# Altium project rv_ledbrick_8ch.PrjPcb
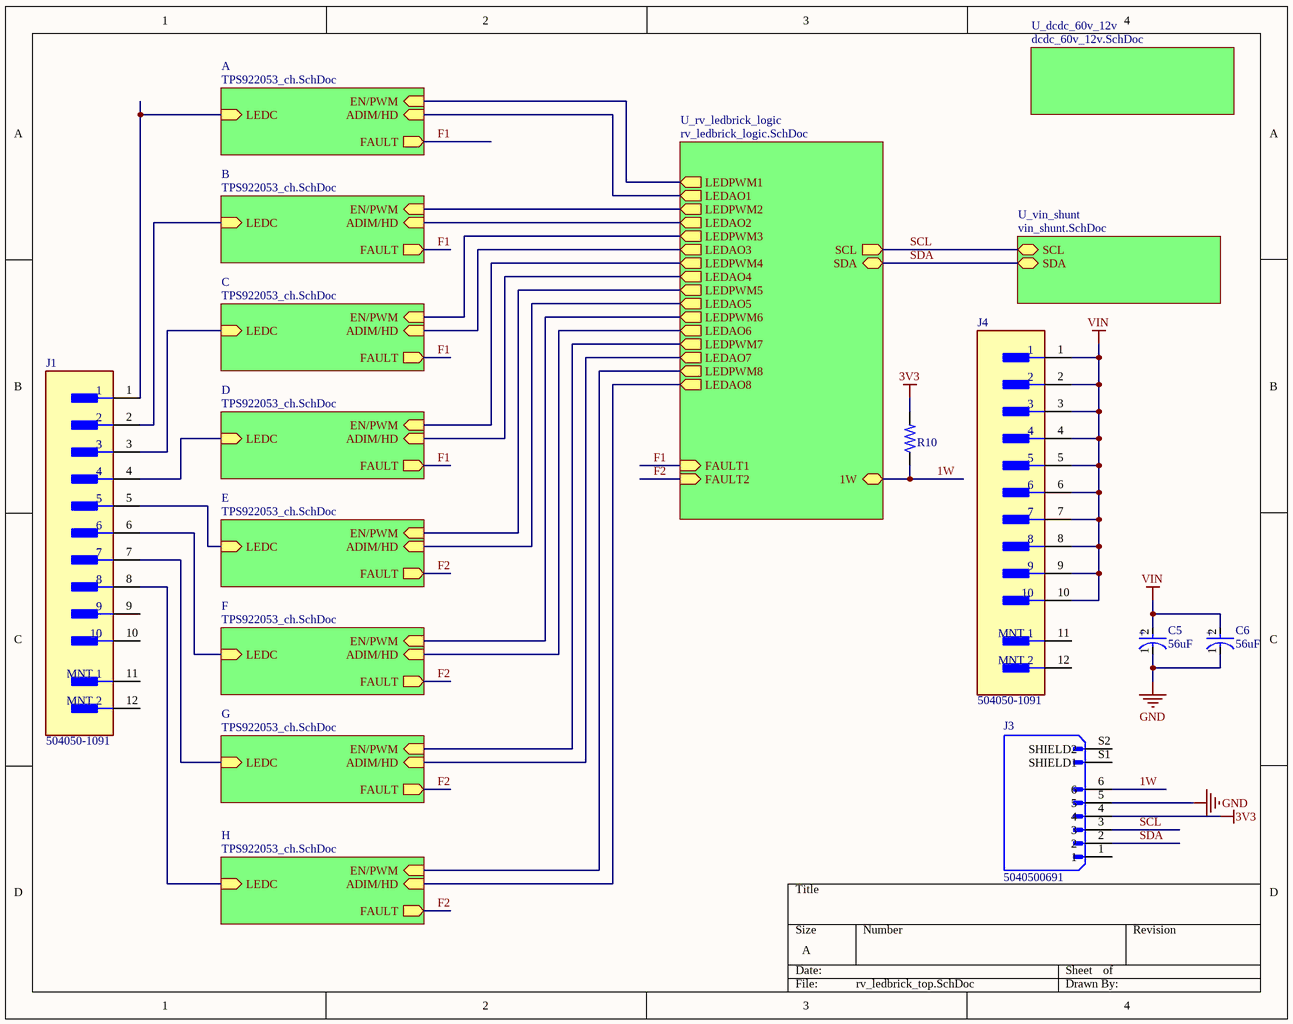
[diagram p0: rv_ledbrick_top.SchDoc]
6 sheets, 212 parts. Net scope: hierarchical (ports join the sheet entries above them; power ports are global).
Board file: rv_ledbrick_8ch.PcbDoc
Sheets:
  rv_ledbrick_top.SchDoc
    A = TPS922053_ch.SchDoc
    B = TPS922053_ch.SchDoc
    C = TPS922053_ch.SchDoc
    D = TPS922053_ch.SchDoc
    E = TPS922053_ch.SchDoc
    F = TPS922053_ch.SchDoc
    G = TPS922053_ch.SchDoc
    H = TPS922053_ch.SchDoc
    U_dcdc_60v_12v = dcdc_60v_12v.SchDoc
    U_rv_ledbrick_logic = rv_ledbrick_logic.SchDoc
      U_usb_input = usb_input.SchDoc
    U_vin_shunt = vin_shunt.SchDoc

## Sheet rv_ledbrick_top.SchDoc
size A; SheetNumber: 1; SheetTotal: 6

### Parts
C5  value 56uF  [FP-OS-CON-SMT-F12-MFG]  (hidden comment: CAP 56uF 80V Poly)
C6  value 56uF  [FP-OS-CON-SMT-F12-MFG]  (hidden comment: CAP 56uF 80V Poly)
J1  504050-1091  [FP-504050-1091-MFG]
J3  5040500691  [MOLEX_5040500691]
J4  504050-1091  [FP-504050-1091-MFG]
R10  4.7k 0603 1%  [RESC1608-IPC-LL]  (value not drawn)

### Sub-sheets
A = TPS922053_ch.SchDoc: LEDC (in), ADIM/HD (in), EN/PWM (in), FAULT (out)
B = TPS922053_ch.SchDoc: LEDC (in), ADIM/HD (in), EN/PWM (in), FAULT (out)
C = TPS922053_ch.SchDoc: LEDC (in), ADIM/HD (in), EN/PWM (in), FAULT (out)
D = TPS922053_ch.SchDoc: LEDC (in), ADIM/HD (in), EN/PWM (in), FAULT (out)
E = TPS922053_ch.SchDoc: LEDC (in), ADIM/HD (in), EN/PWM (in), FAULT (out)
F = TPS922053_ch.SchDoc: LEDC (in), ADIM/HD (in), EN/PWM (in), FAULT (out)
G = TPS922053_ch.SchDoc: LEDC (in), ADIM/HD (in), EN/PWM (in), FAULT (out)
H = TPS922053_ch.SchDoc: LEDC (in), ADIM/HD (in), EN/PWM (in), FAULT (out)
U_dcdc_60v_12v = dcdc_60v_12v.SchDoc: no entries
U_rv_ledbrick_logic = rv_ledbrick_logic.SchDoc: SDA (bidir), SCL (out), LEDPWM1 (out), LEDPWM2 (out), LEDPWM3 (out), LEDPWM4 (out), LEDPWM5 (out), LEDPWM6 (out), LEDPWM7 (out), LEDPWM8 (out), LEDAO1 (out), LEDAO2 (out), LEDAO3 (out), LEDAO4 (out), LEDAO5 (out), LEDAO6 (out), LEDAO7 (out), LEDAO8 (out), FAULT1 (in), FAULT2 (in), 1W (bidir)
U_vin_shunt = vin_shunt.SchDoc: SCL (bidir), SDA (bidir)

### Nets
3V3: J3.4 R10.2
GND: C5.1(C) C6.1(C) J3.5
VIN: C5.2(A) C6.2(A) J4.1 J4.2 J4.3 J4.4 J4.5 J4.6 J4.7 J4.8 J4.9 J4.10
1W: J3.6 R10.1 ; sheet U_rv_ledbrick_logic/1W
CSP: J1.1 ; sheet A/LEDC
CSP: J1.2 ; sheet B/LEDC  [a separate net that carries the same name]
CSP: J1.3 ; sheet C/LEDC  [a separate net that carries the same name]
CSP: J1.4 ; sheet D/LEDC  [a separate net that carries the same name]
CSP: J1.5 ; sheet E/LEDC  [a separate net that carries the same name]
CSP: J1.6 ; sheet F/LEDC  [a separate net that carries the same name]
CSP: J1.7 ; sheet G/LEDC  [a separate net that carries the same name]
CSP: J1.8 ; sheet H/LEDC  [a separate net that carries the same name]
F1: sheet A/FAULT, sheet B/FAULT, sheet C/FAULT, sheet D/FAULT, sheet U_rv_ledbrick_logic/FAULT1
F2: sheet E/FAULT, sheet F/FAULT, sheet G/FAULT, sheet H/FAULT, sheet U_rv_ledbrick_logic/FAULT2
LEDAO1: sheet A/ADIM/HD, sheet U_rv_ledbrick_logic/LEDAO1
LEDAO2: sheet B/ADIM/HD, sheet U_rv_ledbrick_logic/LEDAO2
LEDAO3: sheet C/ADIM/HD, sheet U_rv_ledbrick_logic/LEDAO3
LEDAO4: sheet D/ADIM/HD, sheet U_rv_ledbrick_logic/LEDAO4
LEDAO5: sheet E/ADIM/HD, sheet U_rv_ledbrick_logic/LEDAO5
LEDAO6: sheet F/ADIM/HD, sheet U_rv_ledbrick_logic/LEDAO6
LEDAO7: sheet G/ADIM/HD, sheet U_rv_ledbrick_logic/LEDAO7
LEDAO8: sheet H/ADIM/HD, sheet U_rv_ledbrick_logic/LEDAO8
LEDPWM1: sheet A/EN/PWM, sheet U_rv_ledbrick_logic/LEDPWM1
LEDPWM2: sheet B/EN/PWM, sheet U_rv_ledbrick_logic/LEDPWM2
LEDPWM3: sheet C/EN/PWM, sheet U_rv_ledbrick_logic/LEDPWM3
LEDPWM4: sheet D/EN/PWM, sheet U_rv_ledbrick_logic/LEDPWM4
LEDPWM5: sheet E/EN/PWM, sheet U_rv_ledbrick_logic/LEDPWM5
LEDPWM6: sheet F/EN/PWM, sheet U_rv_ledbrick_logic/LEDPWM6
LEDPWM7: sheet G/EN/PWM, sheet U_rv_ledbrick_logic/LEDPWM7
LEDPWM8: sheet H/EN/PWM, sheet U_rv_ledbrick_logic/LEDPWM8
SCL: J3.3 ; sheet U_rv_ledbrick_logic/SCL, sheet U_vin_shunt/SCL
SDA: J3.2 ; sheet U_rv_ledbrick_logic/SDA, sheet U_vin_shunt/SDA

Not connected (* = marked no-connect by the designer): J1 9 10 11(MNT_1) 12(MNT_2); J3 1 S1(SHIELD1) S2(SHIELD2); J4 11(MNT_1) 12(MNT_2)

### Notes on the sheet
- (in symbol CMP-001-00120-1) +

### Library data of the parts
C5 C6 = CMP-001-00120-1: Conductive Polymer Aluminum Solid Capacitor 56uF 20% 80V Surface Mount T/R; ESR (Equivalent Series Resistance): 28mR; Mounting Technology: Surface Mount; Min Operating Temperature: -55°C; RoHS Compliant: Yes; Max Operating Temperature: 125°C; Voltage Rating: 80V; Series: OS-CON™, SXV; Tolerance: 20%; Case/Package: Radial
J1 J4 = CMP-002-00088-1: Conn Wire to Board HDR 10 POS 1.5mm Solder RA SMD Pico-Lock™ T/R
J3 = CMP-253-000000-2: CONN WIRE TO BOARD RA 6POS; Number of Circuits: 6; Gender: Male; Voltage Rating: 150V; Connector Type: Blade Pin; Current Rating: 3A; Glow Wire Compliant: Non-compliant; Pitch: 1.5mm; Component Type: Standard; Pin Count: 8; Housing Color: Black; Min Operating Temperature: -25°C; Halogen Free: Low Halogen; Value: *; Number of Positions: 6; Orientation: Right Angle; Color: Black; Design Item ID: 5040500691; Availability: Unavailable; Price: None; Max Operating Temperature: 85°C; Packaging: Tape and Reel; Length: 13.55mm; Number of Rows: 1; Contact Gender: Male; Number of Contacts: 6; Contact Plating: Gold; Package Quantity: 2700; Radiation Hardening: No; Termination: SMD/SMT; Contact Material: Copper Alloy,Copper; Source: 5040500691.SchLib; RoHS Compliant: Yes; Housing Material: Thermoplastic; MP: 5040500691; Flammability Rating: UL94 V-0; Mounting Technology: Surface Mount; Package: None; Depth: 6.44mm
R10 = CMP-009-00205-1: RES SMD 4.7K OHM 1% 1/10W 0603

## Sheet TPS922053_ch.SchDoc
size A; SheetNumber: 2; SheetTotal: 5
Used 8 times, as channels A, B, C, D, E, F, G, H. Parts and nets are listed once, with the designators drawn on the sheet.
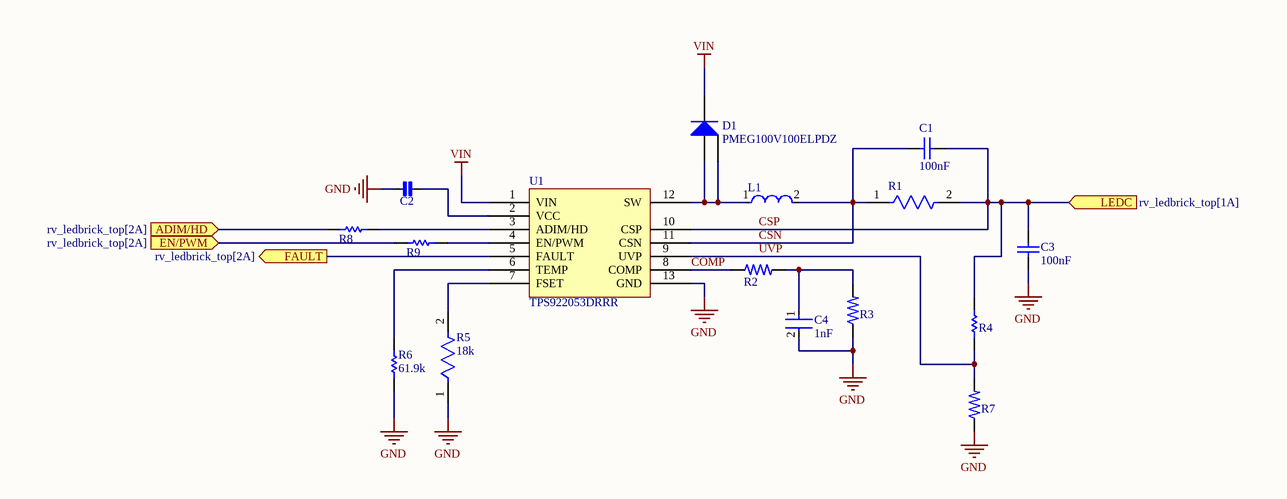
[diagram p1: TPS922053_ch.SchDoc]

### Parts
C1  value 100nF  [CAPC2013X94X50NL20T25]  (hidden comment: 0.1uF X7R 100V 0805)
C2  CAP 1uF 10V X7R 0603  [FP-CL10-IPC_B]  (value not drawn)
C3  value 100nF  [CAPC2013X94X50NL20T25]  (hidden comment: 0.1uF X7R 100V 0805)
C4  value 1nF  [FP-0603-L_1_6_0_15-W_0_81-IPC_B]  (hidden comment: 0.001uF 50V 0603 X7R)
D1  PMEG100V100ELPDZ  [DFN355P580X82-3N]
L1  MWSA0603S-100MT  [FP-IHLP-2525CZ-FP_2_413x3-MFG]  (value not drawn)
R1  MFL12HR100FT  [FP-CRA2512-MFG]  (value not drawn)
R2  1K 0603 1%  [RESC1608-IPC-NL]  (value not drawn)
R3  1M 0603 1%  [RESC1608-IPC-NL]  (value not drawn)
R4  309k 0603 1%  [RESC1608-IPC-NL]  (value not drawn)
R5  value 18k  [FP-CRCW0603-e3-IPC_B]  (hidden comment: 18k 0603)
R6  value 61.9k  [RESC1608X55X30ML15T15]  (hidden comment: ERJ-3EKF6192V)
R7  100k 0603 1%  [RESC1608-IPC-NL]  (value not drawn)
R8  10R 0603 1%  [RESC1608-IPC-NL]  (value not drawn)
R9  10R 0603 1%  [RESC1608-IPC-NL]  (value not drawn)
U1  TPS922053DRRR  [SON50P300X100_HS-13N]

### Ports
ADIM/HD (in, see rv_ledbrick_top[2A]), EN/PWM (in, see rv_ledbrick_top[2A]), FAULT (out, see rv_ledbrick_top[2A]), LEDC (in, see rv_ledbrick_top[1A])

### Nets
GND: C2.1 C3.1 C4.2 R3.1 R5.1 R6.1 R7.1 U1.13(GND)
VIN: D1.3(K) U1.1(VIN)
ADIM/HD: R8.1 ; port ADIM/HD
COMP: R2.1 U1.8(COMP)
CSN: C1.2 L1.2 R1.1 U1.11(CSN)
CSP: C1.1 C3.2 R1.2 R4.2 U1.10(CSP) ; port LEDC
EN/PWM: R9.1 ; port EN/PWM
FAULT: U1.5(FAULT) ; port FAULT
UVP: R4.1 R7.2 U1.9(UVP)
NetC2_2: C2.2 U1.2(VCC)
NetC4_1: C4.1 R2.2 R3.2
NetD1_1: D1.1(A) D1.2(A2) L1.1 U1.12(SW)
NetR5_2: R5.2 U1.7(FSET)
NetR6_2: R6.2 U1.6(TEMP)
NetR8_2: R8.2 U1.3(ADIM/HD)
NetR9_2: R9.2 U1.4(EN/PWM)

### Channels
A: designators end in _A; ports ADIM/HD=LEDAO1 EN/PWM=LEDPWM1 FAULT=F1 LEDC=CSP
B: designators end in _B; ports ADIM/HD=LEDAO2 EN/PWM=LEDPWM2 FAULT=F1 LEDC=CSP
C: designators end in _C; ports ADIM/HD=LEDAO3 EN/PWM=LEDPWM3 FAULT=F1 LEDC=CSP
D: designators end in _D; ports ADIM/HD=LEDAO4 EN/PWM=LEDPWM4 FAULT=F1 LEDC=CSP
E: designators end in _E; ports ADIM/HD=LEDAO5 EN/PWM=LEDPWM5 FAULT=F2 LEDC=CSP
F: designators end in _F; ports ADIM/HD=LEDAO6 EN/PWM=LEDPWM6 FAULT=F2 LEDC=CSP
G: designators end in _G; ports ADIM/HD=LEDAO7 EN/PWM=LEDPWM7 FAULT=F2 LEDC=CSP
H: designators end in _H; ports ADIM/HD=LEDAO8 EN/PWM=LEDPWM8 FAULT=F2 LEDC=CSP

### Library data of the parts
C1 C3 = CMP-001-00130-1: Ceramic Capacitor, Multilayer, Ceramic, 100V, 5% +Tol, 5% -Tol, X7R, 15% TC, 0.1uF, Surface Mount, 0805; Multilayer: Yes; Packaging: Tape and Reel; Case/Package: 0805; RoHS Compliant: Yes; JESD-609 Code: e3; Temperature Characteristics Code: X7R; Tolerance  (fill in as +-): 5%; Height: 1.4mm; Tolerance (fill in as +-): 5%; Length: 2.01mm; Terminal Finish: Nickel; Package Style: SMTMeter; Mounting Technology: Surface Mount; Reach SVHC Compliant: Yes; Max Operating Temperature: 125°C; Termination: Wraparound; Dielectric Material: Ceramic; Width: 1.25mm; Min Operating Temperature: -55°C; Package Shape: Rectangular; Pins: 2; Capacitor Type: Ceramic; Rated DC Voltage (URdc): 100V
C2 = CMP-001-00085-7: Cap Ceramic 1uF 10V X7R 10% SMD 0603 125C Paper T/R
C4 = CMP-001-00131-2: Ceramic Capacitor, Multilayer, Ceramic, 50V, 10% +Tol, 10% -Tol, X7R, 15% TC, 0.001uF, Surface Mount, 0603; Multilayer: Yes; Rated DC Voltage (URdc): 50V; JESD-609 Code: e3; Package Style: SMTMeter; Width: 0.81mm; Terminal Finish: Nickel; Tolerance  (fill in as +-): 10%; RoHS Compliant: Yes; Mounting Technology: Surface Mount; Min Operating Temperature: -55°C; Tolerance (fill in as +-): 10%; Case/Package: 0603; Capacitor Type: Ceramic; Temperature Characteristics Code: X7R; Termination: Wraparound; Packaging: Tape and Reel; Length: 1.6mm; Max Operating Temperature: 125°C; Height: 0.9mm; Pins: 2; Reach SVHC Compliant: Yes; Package Shape: Rectangular; Dielectric Material: Ceramic
D1 = CMP-004-00041-2: Rectifier Diode, Schottky, 1 Phase, 1 Element, 100V V(RRM), Silicon; Reverse Recovery Time-Max: 0.014us; Case Connection: CATHODE; Non-rep Pk Forward Current-Max: 170A; Reference Standard: AEC-Q101; Max Reverse Current: 800nA; Package Body Material: Plastic; Number of Phases: 1; Application(s): EFFICIENCY; Forward Voltage: 850mV; Max Power Dissipation: 1.66W; Technology: SCHOTTKY; Reach SVHC Compliant: No; Diode Element Material: SILICON; Terminal Form: Flat; RoHS Compliant: Yes; Max Operating Temperature: 175°C; Rep Pk Reverse Voltage-Max: 100V; Diode Type: RECTIFIER; Min Operating Temperature: -55°C; Surface Mount: Yes; Package Shape: Rectangular; JESD-30 Code: R-PDSO-F3; Terminal Position: DUAL; Number of Elements: 1; Package Style: SMALL OUTLINEMeter; Pins: 3
L1 = CMP-006-00037-1: General Purpose Inductor, 10uH, 20%, 1 Element, Composite-Core, SMD, 2525; Case/Size Code: 2525; Inductor Application: HIGH CURRENT INDUCTOR; Package Length: 6.86mm; Shape/Size Description: RECTANGULAR PACKAGE; Package Height: 3mm; Core Material: Ferrite; Max Current Rating: 4A; Test Frequency: 100kHz; DC Resistance (DCR): 71.2mR; Channels: 1; Package Width: 6.47mm; Shielding: Shielded; Pins: 2; Terminal Placement: Dual Ended; Min Operating Temperature: -55°C; Inductance-Nom (L): 10uH; Surface Mount: Yes; Package Style: SMTMeter; Packaging: Tape and Reel; RoHS Compliant: Yes; Termination: Wraparound; Max Operating Temperature: 125°C; Terminal Finish: Nickel; Inductor Type: GENERAL PURPOSE INDUCTOR; Reach SVHC Compliant: Yes; Tolerance: 20%; JESD-609 Code: e3; Construction: Shielded
R1 = CMP-009-00243-1: Fixed Resistor, Metal Strip, 3W, 0.1ohm, 5.48V, 1% +/-Tol, 50ppm/Cel, Surface Mount, 2513
R2 = CMP-009-00193-3: Res Thick Film 0603 1K Ohm 1% 1/10W ±100ppm/°C Molded SMD Punched Carrier T/R
R3 = CMP-009-00187-4: VISHAY - CRCW06031M00FKEAHP - RES, AEC-Q200, THICK FILM, 1M, 0603
R4 = CMP-009-00208-2: Res Thick Film 0603 309K Ohm 1% 0.1W(1/10W) ±100ppm/C Molded SMD Paper T/R
R5 = CMP-009-00244-2: Fixed Resistor, Metal Glaze/thick Film, 0.1W, 18000ohm, 75V, 1% +/-Tol, 100ppm/Cel, Surface Mount, 0603; Rated Temperature: 70°C; Package Length: 1.55mm; Reference Standard: AEC-Q200; Package Height: 0.45mm; Package Width: 0.85mm; Power: 100mW; Temperature Coefficient: 100ppm/°C; Case/Package: 0603; Construction: Chip; Package Shape: Rectangular; Tolerance: 1%; Max Operating Temperature: 155°C; RoHS Compliant: Yes; Resistor Type: FIXED RESISTOR; Packaging: Tape and Reel; Terminal Finish: Nickel; Reach SVHC Compliant: Yes; Technology: METAL GLAZE/THICK FILM; Termination: Wraparound; Mounting Technology: Surface Mount; Min Operating Temperature: -55°C; JESD-609 Code: e3; Pins: 2; Package Style: SMTMeter; Working Voltage: 75V
R6 = CMP-009-00245-1: Fixed Resistor, Metal Glaze/thick Film, 0.1W, 61900ohm, 75V, 1% +/-Tol, 100ppm/Cel, Surface Mount, 0603; Package Length: 1.6mm; Package Height: 0.45mm; Rated Temperature: 70°C; Reference Standard: AEC-Q200; Package Width: 0.8mm; Temperature Coefficient: 100ppm/°C; Power: 100mW; Working Voltage: 75V; Reach SVHC Compliant: Yes; Tolerance: 1%; JESD-609 Code: e3; Terminal Finish: Nickel; Resistor Type: FIXED RESISTOR; Min Operating Temperature: -55°C; Max Operating Temperature: 155°C; Technology: METAL GLAZE/THICK FILM; Package Style: SMTMeter; Case/Package: 0603; Construction: Rectangular; Pins: 2; Packaging: Tape and Reel; RoHS Compliant: Yes; Mounting Technology: Surface Mount; Termination: Wraparound; Package Shape: Rectangular
R7 = CMP-009-00203-1: Res Thick Film 1.6 x 0.8 mm 100K Ohm 1% 0.1W(1/10W) 100ppm/ C Molded SMD Paper T/R
R8 R9 = CMP-009-00180-2: YAGEO (PHYCOMP) - RC0603FR-0710RL - RES, THICK FILM, 10R, 1%, 0.1W, 0603; Voltage Rating: 50V; Power Rating: 100mW; Temperature Coefficient: 200ppm/°C; Resistor Type: Thick Film; Width: 0.8mm; Max Operating Temperature: 155°C; Tolerance: 1%; Radiation Hardening: No; Packaging: Tape and Reel; Case Code (Imperial): 0603; Min Operating Temperature: -55°C; Termination: SMD/SMT; Length: 1.6mm; Military Standard: Not; Case Code (Metric): 1608; Contact Plating: Tin,Matte; Height: 0.45mm; REACH SVHC: No SVHC; Voltage Rating (DC): 50V; Number of Pins: 2; Depth: 0.8mm; Lead Free: Lead Free; Resistance: 10R; Case/Package: 0603
U1 = CMP-019-00085-2: 65-V, 2-A buck LED driver with inductive fast dimming and spread spectrum 12-WSON -40 to 125

## Sheet dcdc_60v_12v.SchDoc
size A4; SheetNumber: 5; SheetTotal: 6; SPICEModelCacheOFSRASBJ: <root> / <DocumentId>OFSRASBJ</DocumentId> / <CacheFrame Number="0"> / <Model Name="tmk325b7226_m-pr" Kind="CKT"> / <Text>* TMK325B7226_M-PR     SPICE MODEL  ( General Type ) / *-------------------------------------------------------------------------------------------------------- / * Model Generated by TAIYO YUDEN Corporation (http://www.ty-top.com) / * Version 1.0 / * TAIYO YUDEN Control No. 170508_150330 / * Copyright(c) 2015 TAIYO YUDEN CO.,LTD. All Rights Reserved. / *-------------------------------------------------------------------------------------------------------- / * / * Products Name : Multilayer Ceramic Capacitors / * / * Characteristics : / *     Capacitance : 22 uF , Rated Voltage : 25V , TCC : X7R / *     Case Size : 3.2 x 2.5 / 0.126 x 0.098 [mm/inch] , Thickness : 2.5 / 0.098 [mm/inch] / *     (Conditions: Temperature = 25 degC , DC Bias Current/Voltage = 0A / 0V) / * / * Frequency Range : 40Hz - 3GHz / * / * External Node Assignments : / * / *  1  o---| |---o  2 / * / *-------------------------------------------------------------------------------------------------------- / .SubCkt TMK325B7226_M-PR 1 2 / **************************** / C0 1 110 20.232u / Cm 1 101 1.4192u / C1 101 102 0.46072u / Rc1 101 102 383.24 / C2 102 103 0.25707u / Rc2 102 103 27.255 / C3 103 110 0.063707u / Rc3 103 110 9.0927 / C2m 1 301 2.8514u / C21 301 302 4.5381u / Rc21 301 302 971.82 / C22 302 303 5.7922u / Rc22 302 303 294.55 / C23 303 304 5.617u / Rc23 303 304 301.8 / C24 304 305 2.3653u / Rc24 304 305 34.154 / C25 305 306 1.0031u / Rc25 305 306 28.966 / C26 306 307 0.1463u / Rc26 306 307 1.8028 / C27 307 308 0.26562u / Rc27 307 308 0.93359 / C28 308 309 0.29812u / Rc28 308 309 0.7461 / C29 309 110 3869.2p / Rc29 309 110 3.935 / Rp0 1 110 4.54545454545455Meg / L0 110 120 0.19079n / Lm 120 130 0.18902n / L1 120 121 0.21321n / RL1 121 130 0.13225 / L2 120 122 0.31017n / RL2 122 130 0.16258 / L3 120 123 1.2596n / RL3 123 130 144.01 / CR 120 124 3.8286u / LR 124 125 0.37731n / RR 125 130 10.878m / CL 130 140 3.0471p / LL 130 140 0.15642n / RL 130 140 11.971 / Rs 140 2 2.3557m / **************************** / .ends TMK325B7226_M-PR</Text> / </Model> / </CacheFrame> / </root>
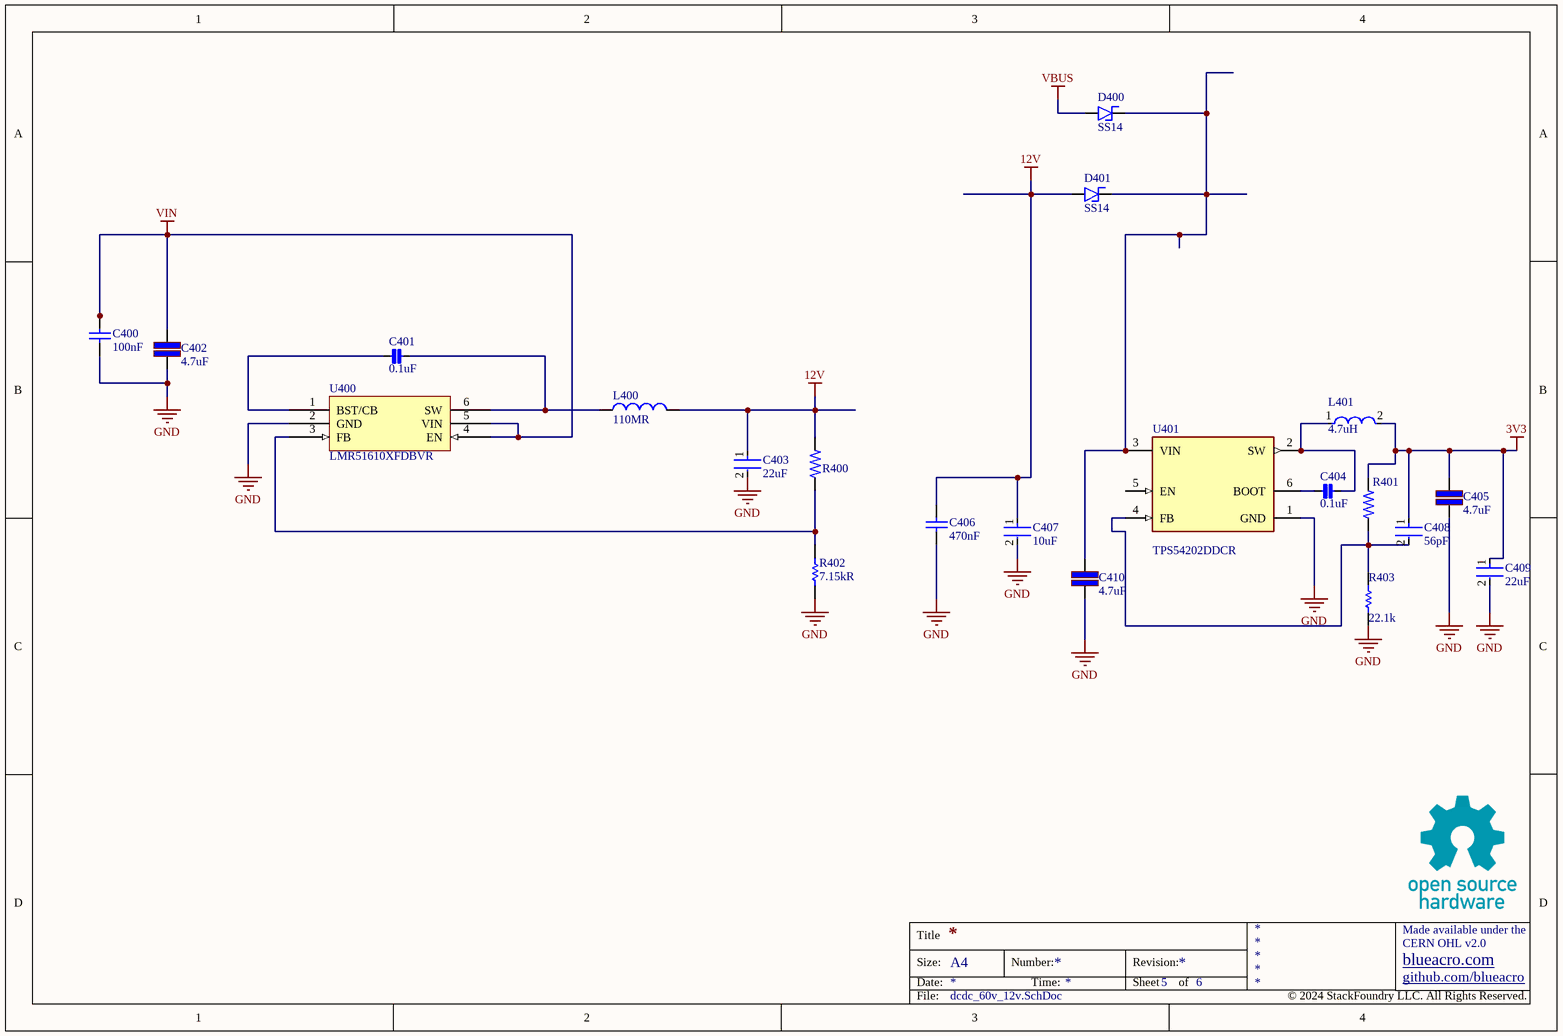
[diagram p2: dcdc_60v_12v.SchDoc]

### Parts
C400  value 100nF  [CAPC2013X94X50ML20T25]  (hidden comment: 0.1uF X7R 100V 0805)
C401  value 0.1uF  [FP-CL10-IPC_B]  (hidden comment: CAP 0.1uF 50V X7R 0603)
C402  value 4.7uF  [CAPC3225X20N]  (hidden comment: CAP 4.7uF 50V X7R 1210)
C403  value 22uF  [FP-1210-L_3_2_0_3-W_2_5_0-MFG]  (hidden comment: CAP 22uF 25V 1210 X7R)
C404  value 0.1uF  [FP-CL10-IPC_B]  (hidden comment: CAP 0.1uF 50V X7R 0603)
C405  value 4.7uF  [CAPC3225X20N]  (hidden comment: CAP 4.7uF 50V X7R 1210)
C406  value 470nF  [CAPC1210(3225)230_M]  (hidden comment: CAP 0.47uF 1210 50V X7R)
C407  value 10uF  [FP-GRM32E-0_2-0_3-MFG]  (hidden comment: CAP 10uF 1210 63V X7R)
C408  value 56pF  [FP-C0603C-CF-IPC_B]  (hidden comment: C0603C560J5GACTU)
C409  value 22uF  [FP-1210-L_3_2_0_3-W_2_5_0-MFG]  (hidden comment: CAP 22uF 25V 1210 X7R)
C410  value 4.7uF  [CAPC3225X20N]  (hidden comment: CAP 4.7uF 50V X7R 1210)
D400  SS14  [SMA]
D401  SS14  [SMA]
L400  value 110MR  [SRR1260-680M-Footprint-1]  (hidden comment: SRR1260-680M)
L401  value 4.7uH  [FP-SRN4018-MFG]  (hidden comment: SRN4018-4R7M)
R400  100k 0603 1%  [RESC1608-IPC-LL]  (value not drawn)
R401  100k 0603 1%  [RESC1608-IPC-LL]  (value not drawn)
R402  value 7.15kR  [RESC1608X55X30NL20T20]  (hidden comment: 7.15k 0603 0.1%)
R403  value 22.1k  [RESC1608-IPC-LL]  (hidden comment: 22.1k 0603 0.1%)
U400  LMR51610XFDBVR  [SOT95P280X145-6N]
U401  TPS54202DDCR  [FP-DDC0006A-IPC_C]

### Nets
3V3: C405.2 C408.1 C409.1 L401.2 R401.2
12V: C403.1 C406.2 C407.1 D401.A L400.2 R400.2
GND: C400.1 C402.1 C403.2 C405.1 C406.1 C407.2 C409.2 C410.1 R402.1 R403.1 U400.2(GND) U401.1(GND)
VBUS: D400.A
VIN: C400.2 C402.2 U400.4(EN) U400.5(VIN)
NetC401_1: C401.1 U400.1(BST/CB)
NetC401_2: C401.2 L400.1 U400.6(SW)
NetC404_1: C404.1 U401.6(BOOT)
NetC404_2: C404.2 L401.1 U401.2(SW)
NetC408_2: C408.2 R401.1 R403.2 U401.4(FB)
NetC410_2: C410.2 D400.K D401.K U401.3(VIN)
NetR400_1: R400.1 R402.2 U400.3(FB)

Not connected (* = marked no-connect by the designer): U401 5(EN)

### Notes on the sheet
- Title
- Size:
- Date:
- A4
- Number:
- Time:
- Revision:
- Sheet
- of
- github.com/blueacro
- blueacro.com
- CERN OHL v2.0
- Made available under the
- File:
- © 2024 StackFoundry LLC. All Rights Reserved.

### Library data of the parts
C400 = CMP-001-00130-1: as C1 on sheet TPS922053_ch; Packaging: Tape and Reel; Case/Package: 0805; RoHS Compliant: Yes; JESD-609 Code: e3; Temperature Characteristics Code: X7R; Tolerance  (fill in as +-): 5%; Height: 1.4mm; Tolerance (fill in as +-): 5%; Length: 2.01mm; Terminal Finish: Nickel; Package Style: SMTMeter; Mounting Technology: Surface Mount; Reach SVHC Compliant: Yes; Max Operating Temperature: 125°C; Termination: Wraparound; Dielectric Material: Ceramic; Width: 1.25mm; Min Operating Temperature: -55°C; Package Shape: Rectangular; Pins: 2; Capacitor Type: Ceramic; Rated DC Voltage (URdc): 100V
C401 C404 = CMP-001-00084-7: Cap Ceramic 0.1uF 50V X7R 20% SMD 0603 125C Paper T/R; Voltage: 50V
C402 C405 C410 = CMP-001-00083-3: CAP CER 4.7UF 50V X7R 1210; Tolerance: 10%; Material: Ceramic; Voltage: 50V; Capacitance: 4.7uF; Width: 0.098inch; Height: 1.8mm; Depth: 2.5mm; Package Quantity: 1; Case/Package: 1210; Case Code (Imperial): 1210; Contact Plating: Tin; Thickness: 0.079inch; Radiation Hardening: No; Voltage Rating: 50V; Packaging: Tape and Reel; Lead Free: Lead Free; Dielectric: X7R; Min Operating Temperature: -55°C; Case Code (Metric): 3225; Max Operating Temperature: 125°C; Mount: Surface Mount; Length: 3.2mm
C403 C409 = CMP-001-00125-1: 1210 22 uF 25 V ±20% Tolerance X7R Multilayer Ceramic Chip Capacitor; Tolerance: 20%; Series: M; Max Operating Temperature: 125°C; Min Operating Temperature: -55°C; Case Code (Metric): 3225; Mounting Technology: Surface Mount; Case/Package: 1210; RoHS Compliant: Yes; Voltage Rating: 25V; Packaging: Tape and Reel; Case Code (Imperial): 1210
C406 = CMP-001-00128-1: Multilayer Ceramic Capacitor, 0.47 uF, 50 V, ± 10%, X7R, 1210 [3225 Metric]; Height: 0.95mm; Tolerance: 10%; Length: 3.2mm; Voltage Rating: 50V; Depth: 2.5mm; Case Code (Metric): 3225; Voltage: 50V; Lead Free: Lead Free; Series: C; Dielectric: X7R; Dielectric Material: Ceramic; Construction: Flat; Case Code (Imperial): 1210; Case/Package: 1210; Thickness: 0.041inch; RoHS Compliant: Yes; Package Quantity: 1; Width: 0.098inch; Reach SVHC Compliant: No; Voltage Rating (DC): 50V; Termination: SMD/SMT; Min Operating Temperature: -55°C; Packaging: Tape and Reel; Mounting Technology: Surface Mount,PCB; Max Operating Temperature: 125°C
C407 = CMP-001-00119-1: Multilayer Ceramic Capacitors MLCC - SMD/SMT 1210 10uF 63volts *Derate Voltage/Temp; Tolerance: 10%; Series: GRM; Case Code (Metric): 3225; Case/Package: 1210; Voltage Rating: 63V; Case Code (Imperial): 1210; Voltage: 63V; Thickness: 0.106inch; Dielectric Material: Ceramic; Depth: 2.5mm; Material: Ceramic; Length: 3.2mm; Height: 2.5mm; Width: 2.5mm; Voltage Rating (DC): 63V; Termination: SMD/SMT; Dielectric: X7R
C408 = CMP-001-00126-1: Multilayer Ceramic Capacitor, 56 pF, 50 V, ± 5%, C0G (NP0), 0603 [1608 Metric]; Temperature Coefficient: 30ppm/°C; Voltage Rating (DC): 50V; Radiation Hardening: No; Min Operating Temperature: -55°C; Pins: 2; Depth: 0.8mm; Termination: SMD/SMT; Dielectric: C0G; Thickness: 0.034inch; Package Quantity: 1; RoHS Compliant: Yes; Reach SVHC Compliant: No; Lead Free: Lead Free; Length: 1.6mm; Mounting Technology: Surface Mount,PCB; Packaging: Tape and Reel; Width: 0.031inch; Height: 0.8mm; Material: Ceramic; Series: C; Case Code (Metric): 1608; Tolerance: 5%; Max Operating Temperature: 125°C; Lead Pitch: 0.7mm; Voltage Rating: 50V; Case Code (Imperial): 0603; Construction: Flat; Case/Package: 0603
D400 D401 = CMP-080-0002-2: Source: diode.SCHLIB; Design Item ID: DIODE_SCHOTTKY
L400 = CMP-006-00034-1: Ind Power Shielded Wirewound 68uH 20% 100KHz 22Q-Factor Ferrite 2.1A T/R; Q Factor: 22; Self Resonant Frequency: 7.43MHz; Material: Steel; Current Rating: 2.1A; Height - Seated (Max): 0.256inch; Termination: SMD/SMT; Inductance Tolerance: 20%; Package Quantity: 600; Tolerance: 20%; Max DC Current: 2.1A; Reach SVHC Compliant: No; Min Operating Temperature: -40°C; Test Frequency: 100kHz; Depth: 12.8mm; Saturation Current: 2.1A; Length: 12.5mm; Width: 12.5mm; Case/Package: 1260; RMS Current (Irms): 2.1A; Frequency: 7.43MHz; Mounting Technology: Surface Mount; Packaging: Tape and Reel; Pins: 2; DC Current: 2.1A; Shielding: Shielded; Max Operating Temperature: 125°C; Sample Rate (Hz): 100kHz; DC Resistance (DCR): 110mR; Height: 6mm; RoHS Compliant: Yes; Series: SRR1260; Military Standard: Not; Core Material: Ferrite
L401 = CMP-006-00036-2: Ind Power Semi-Shielded Wirewound 4.7uH 20% 100KHz Ferrite 1.9A 1515 T/R; Material: Steel; Self Resonant Frequency: 35MHz; DC Resistance (DCR): 84mR; Saturation Current: 2A; Q Factor: 9; Radiation Hardening: No; Reach SVHC Compliant: No; Sample Rate (Hz): 100kHz; Package Quantity: 3000; RoHS Compliant: Yes; Depth: 4.2mm; Max DC Current: 1.9A; Case/Package: Nonstandard; Min Operating Temperature: -25°C; Test Frequency: 100kHz; Max Operating Temperature: 120°C; Pins: 2; Shielding: Shielded; Packaging: Cut Tape; Height - Seated (Max): 0.071inch; Inductance Tolerance: 20%; RMS Current (Irms): 1.9A; Current Rating: 1.9A; Core Material: Ferrite; Width: 4mm; Height: 1.8mm; Tolerance: 20%; Length: 4mm; Series: SRN4018; Termination: SMD/SMT; Mounting Technology: Surface Mount; ESR: 84mR
R400 R401 = CMP-009-00203-1: as R7 on sheet TPS922053_ch
R402 = CMP-009-00235-1: Res Thin Film 0603 7.15K Ohm 0.1% 1/10W ±25ppm/°C Molded SMD SMD Punched Carrier T/R; Voltage Rating: 75V; Power Rating: 100mW; Number of Terminations: 2; Temperature Coefficient: 25ppm/°C; Weight: 7.1E-05oz; Technology: METAL FILM; Contact Plating: Tin; Features: Automotive AEC-Q200; Height: 0.45mm; Termination: SMD/SMT; Case Code (Imperial): 0603; Pins: 2; Case Code (Metric): 1608; Depth: 0.8mm; Mounting Technology: Surface Mount; Reach SVHC Compliant: No; Packaging: Tape and Reel; Width: 0.8mm; Resistance Tolerance: 0.1%; Resistor Type: Thin Film; Min Operating Temperature: -55°C; Series: ERA; Ratings: AEC-Q200; RoHS Compliant: Yes; Case/Package: 0603; Length: 1.6mm; Package Quantity: 1; Voltage Rating (DC): 75V; Lead Free: Lead Free; Max Operating Temperature: 155°C; Max Power Dissipation: 100mW
R403 = CMP-009-00207-3: RES SMD 22.1KOHM 0.1% 1/10W 0603
U400 = CMP-019-00077-1: SIMPLE SWITCHER® power converter with 4.5V-to-65V 1A synchronous buck and 25µA quiescent current 6-SOT-23 -40 to 150
U401 = CMP-019-00081-1: 4.5V to 28V Input, 2A Output, EMI Friendly Synchronous Step-Down Converter 6-SOT-23-THIN -40 to 125; Min Output Voltage: 596mV; Synchronous Rectifier: Yes; Number of Outputs: 1; Output Type: Adjustable; Switching Frequency: 500kHz; Output Configuration: Positive; Max Duty Cycle: 100%; Quiescent Current: 40uA; Nominal Supply Current: 45uA; Mounting Technology: Surface Mount; Series: Eco-Mode™; RoHS Compliant: Yes; Packaging: Tape and Reel; Case/Package: SOT-23-6; Min Input Voltage: 4.5V; Min Operating Temperature: -40°C; Max Supply Voltage: 28V; Max Operating Temperature: 125°C; Max Output Voltage: 28V; Output Current: 2A; Width: 1.6mm; Thickness: 870um; Height: 1.1mm; Min Supply Voltage: 4.5V; Length: 2.9mm; Number of Channels: 1; Lead Free: Lead Free; Pins: 6

## Sheet rv_ledbrick_logic.SchDoc
size A4; SheetNumber: 3; SheetTotal: 6
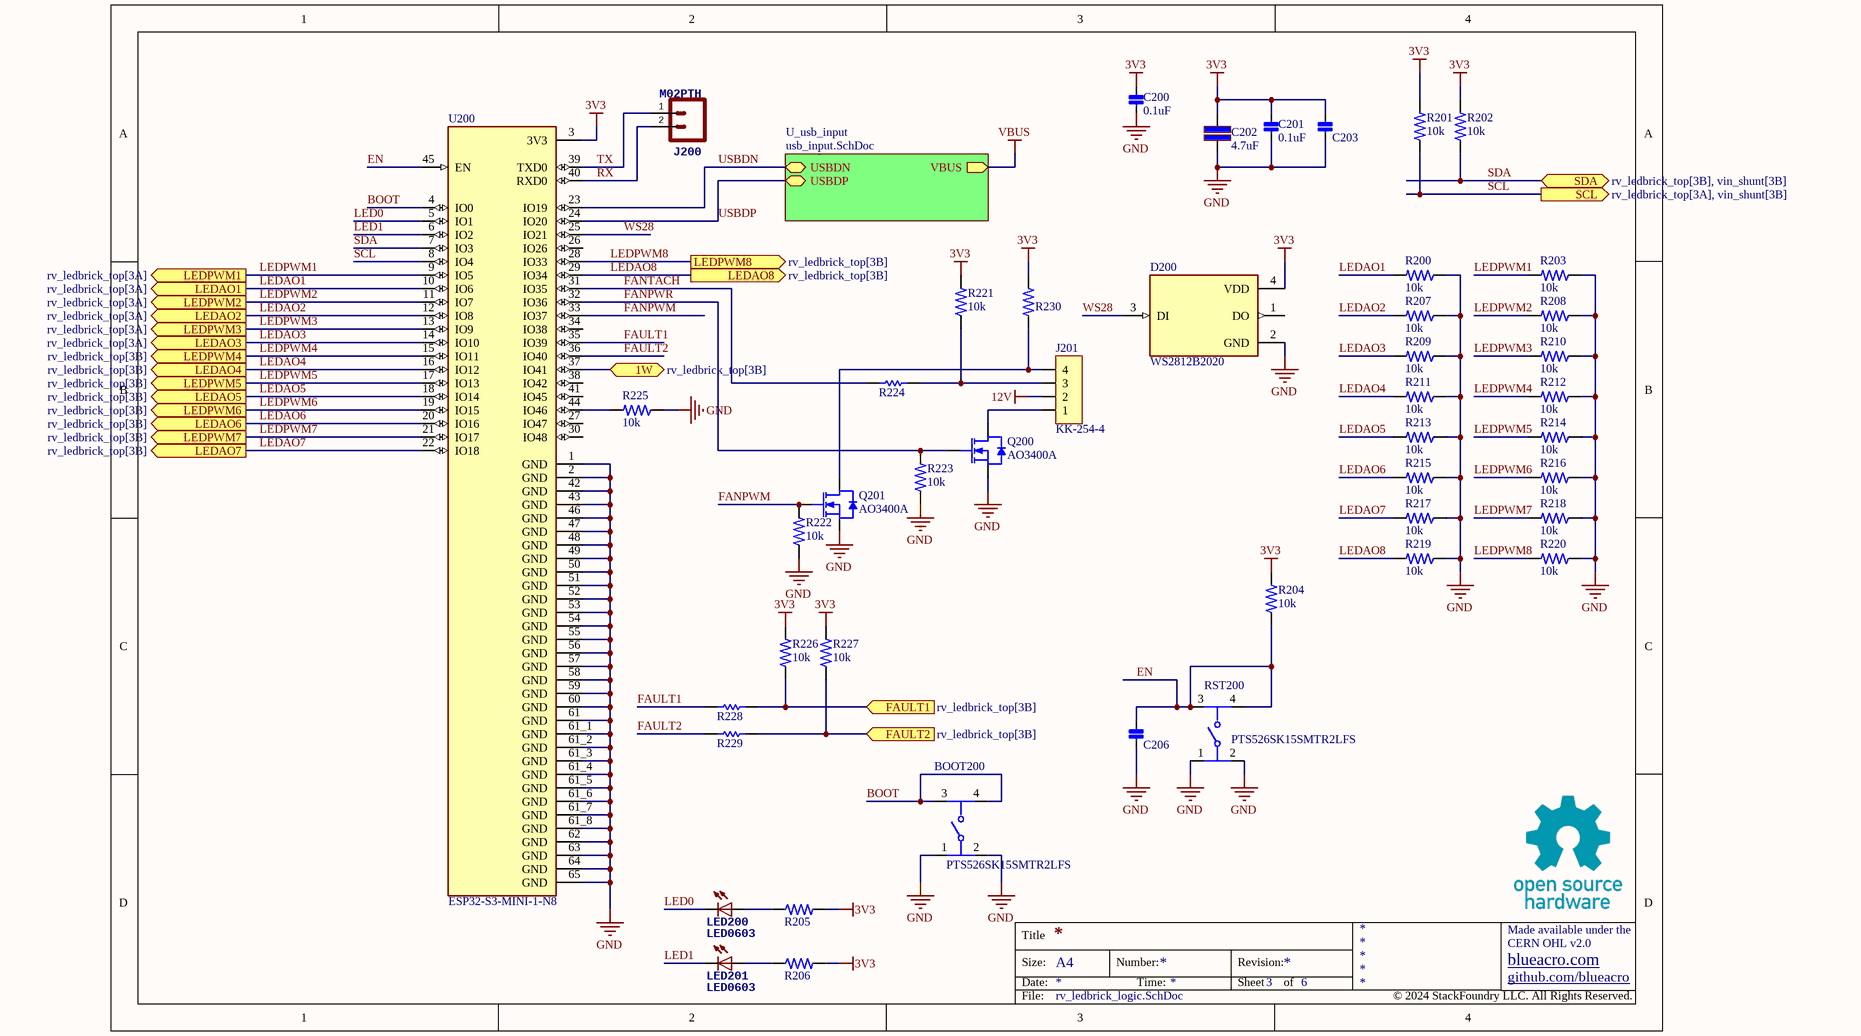
[diagram p3: rv_ledbrick_logic.SchDoc]

### Parts
BOOT200  PTS526SK15SMTR2LFS  [FP-PTS526SK15SMTR2LFS-MFG]
C200  value 0.1uF  [FP-CL10-IPC_B]  (hidden comment: CAP 0.1uF 50V X7R 0603)
C201  value 0.1uF  [FP-CL10-IPC_B]  (hidden comment: CAP 0.1uF 50V X7R 0603)
C202  value 4.7uF  [CAPC3225X20N]  (hidden comment: CAP 4.7uF 50V X7R 1210)
C203  CAP 1uF 10V X7R 0603  [FP-CL10-IPC_B]  (value not drawn)
C206  CAP 1uF 10V X7R 0603  [FP-CL10-IPC_B]  (value not drawn)
D200  WS2812B2020  [LED_WS2812B2020]
J200  M02PTH  [1X02]
J201  KK-254-4  [KK-254-47053-3000]
LED200  LED0603  [LED-0603]
LED201  LED0603  [LED-0603]
Q200  AO3400A  [SOT23-3]
Q201  AO3400A  [SOT23-3]
R200  value 10k  [RESC1608-IPC-NL]  (hidden comment: 10K 0603 1%)
R201  value 10k  [RESC1608-IPC-ML]  (hidden comment: 10K 0603 1%)
R202  value 10k  [RESC1608-IPC-ML]  (hidden comment: 10K 0603 1%)
R203  value 10k  [RESC1608-IPC-NL]  (hidden comment: 10K 0603 1%)
R204  value 10k  [RESC1608-IPC-ML]  (hidden comment: 10K 0603 1%)
R205  1K 0603 1%  [RESC1608-IPC-ML]  (value not drawn)
R206  1K 0603 1%  [RESC1608-IPC-ML]  (value not drawn)
R207  value 10k  [RESC1608-IPC-NL]  (hidden comment: 10K 0603 1%)
R208  value 10k  [RESC1608-IPC-NL]  (hidden comment: 10K 0603 1%)
R209  value 10k  [RESC1608-IPC-NL]  (hidden comment: 10K 0603 1%)
R210  value 10k  [RESC1608-IPC-NL]  (hidden comment: 10K 0603 1%)
R211  value 10k  [RESC1608-IPC-NL]  (hidden comment: 10K 0603 1%)
R212  value 10k  [RESC1608-IPC-NL]  (hidden comment: 10K 0603 1%)
R213  value 10k  [RESC1608-IPC-NL]  (hidden comment: 10K 0603 1%)
R214  value 10k  [RESC1608-IPC-NL]  (hidden comment: 10K 0603 1%)
R215  value 10k  [RESC1608-IPC-NL]  (hidden comment: 10K 0603 1%)
R216  value 10k  [RESC1608-IPC-NL]  (hidden comment: 10K 0603 1%)
R217  value 10k  [RESC1608-IPC-NL]  (hidden comment: 10K 0603 1%)
R218  value 10k  [RESC1608-IPC-NL]  (hidden comment: 10K 0603 1%)
R219  value 10k  [RESC1608-IPC-NL]  (hidden comment: 10K 0603 1%)
R220  value 10k  [RESC1608-IPC-NL]  (hidden comment: 10K 0603 1%)
R221  value 10k  [RESC1608-IPC-ML]  (hidden comment: 10K 0603 1%)
R222  value 10k  [RESC1608-IPC-ML]  (hidden comment: 10K 0603 1%)
R223  value 10k  [RESC1608-IPC-ML]  (hidden comment: 10K 0603 1%)
R224  10R 0603 1%  [RESC1608-IPC-NL]  (value not drawn)
R225  value 10k  [RESC1608-IPC-NL]  (hidden comment: 10K 0603 1%)
R226  value 10k  [RESC1608-IPC-ML]  (hidden comment: 10K 0603 1%)
R227  value 10k  [RESC1608-IPC-ML]  (hidden comment: 10K 0603 1%)
R228  10R 0603 1%  [RESC1608-IPC-NL]  (value not drawn)
R229  10R 0603 1%  [RESC1608-IPC-NL]  (value not drawn)
R230  1K 0603 1%  [RESC1608-IPC-ML]  (value not drawn)
RST200  PTS526SK15SMTR2LFS  [FP-PTS526SK15SMTR2LFS-MFG]
U200  ESP32-S3-MINI-1-N8  [XCVR_ESP32-S3-MINI-1-N8]

### Sub-sheets
U_usb_input = usb_input.SchDoc: USBDN (bidir), USBDP (bidir), VBUS (out)

### Ports
1W (bidir, see rv_ledbrick_top[3B]), FAULT1 (in, see rv_ledbrick_top[3B]), FAULT2 (in, see rv_ledbrick_top[3B]), LEDAO1 (out, see rv_ledbrick_top[3A]), LEDAO2 (out, see rv_ledbrick_top[3A]), LEDAO3 (out, see rv_ledbrick_top[3A]), LEDAO4 (out, see rv_ledbrick_top[3B]), LEDAO5 (out, see rv_ledbrick_top[3B]), LEDAO6 (out, see rv_ledbrick_top[3B]), LEDAO7 (out, see rv_ledbrick_top[3B]), LEDAO8 (out, see rv_ledbrick_top[3B]), LEDPWM1 (out, see rv_ledbrick_top[3A]), LEDPWM2 (out, see rv_ledbrick_top[3A]), LEDPWM3 (out, see rv_ledbrick_top[3A]), LEDPWM4 (out, see rv_ledbrick_top[3B]), LEDPWM5 (out, see rv_ledbrick_top[3B]), LEDPWM6 (out, see rv_ledbrick_top[3B]), LEDPWM7 (out, see rv_ledbrick_top[3B]), LEDPWM8 (out, see rv_ledbrick_top[3B]), SCL (out, see rv_ledbrick_top[3A], vin_shunt[3B]), SDA (bidir, see rv_ledbrick_top[3B], vin_shunt[3B])

### Nets
3V3: C200.1 C201.1 C202.2 C203.1 D200.4(VDD) R201.2 R202.2 R204.2 R205.2 R206.2 R221.2 R226.2 R227.2 R230.2 U200.3(3V3)
12V: J201.2
GND: BOOT200.1 BOOT200.2 C200.2 C201.2 C202.1 C203.2 C206.2 D200.2(GND) Q200.2(S) Q201.2(S) R200.1 R203.1 R207.1 R208.1 R209.1 R210.1 R211.1 R212.1 R213.1 R214.1 R215.1 R216.1 R217.1 R218.1 R219.1 R220.1 R222.1 R223.1 R225.1 RST200.1 RST200.2 U200.1(GND) U200.2(GND) U200.42(GND) U200.43(GND) U200.46(GND) U200.47(GND) U200.48(GND) U200.49(GND) U200.50(GND) U200.51(GND) U200.52(GND) U200.53(GND) U200.54(GND) U200.55(GND) U200.56(GND) U200.57(GND) U200.58(GND) U200.59(GND) U200.60(GND) U200.61(GND) U200.61_1(GND) U200.61_2(GND) U200.61_3(GND) U200.61_4(GND) U200.61_5(GND) U200.61_6(GND) U200.61_7(GND) U200.61_8(GND) U200.62(GND) U200.63(GND) U200.64(GND) U200.65(GND)
1W: U200.37(IO41) ; port 1W
BOOT: BOOT200.3 BOOT200.4 U200.4(IO0)
EN: C206.1 R204.1 RST200.3 RST200.4 U200.45(EN)
F1: R226.1 R228.2 ; port FAULT1
F2: R227.1 R229.2 ; port FAULT2
FANPWM: Q201.1(G) R222.2 U200.33(IO37)
FANPWR: Q200.1(G) R223.2 U200.32(IO36)
FANTACH: R224.1 U200.31(IO35)
FAULT1: R228.1 U200.35(IO39)
FAULT2: R229.1 U200.36(IO40)
LED0: LED200.C U200.5(IO1)
LED1: LED201.C U200.6(IO2)
LEDAO1: R200.2 U200.10(IO6) ; port LEDAO1
LEDAO2: R207.2 U200.12(IO8) ; port LEDAO2
LEDAO3: R209.2 U200.14(IO10) ; port LEDAO3
LEDAO4: R211.2 U200.16(IO12) ; port LEDAO4
LEDAO5: R213.2 U200.18(IO14) ; port LEDAO5
LEDAO6: R215.2 U200.20(IO16) ; port LEDAO6
LEDAO7: R217.2 U200.22(IO18) ; port LEDAO7
LEDAO8: R219.2 U200.29(IO34) ; port LEDAO8
LEDPWM1: R203.2 U200.9(IO5) ; port LEDPWM1
LEDPWM2: R208.2 U200.11(IO7) ; port LEDPWM2
LEDPWM3: R210.2 U200.13(IO9) ; port LEDPWM3
LEDPWM4: R212.2 U200.15(IO11) ; port LEDPWM4
LEDPWM5: R214.2 U200.17(IO13) ; port LEDPWM5
LEDPWM6: R216.2 U200.19(IO15) ; port LEDPWM6
LEDPWM7: R218.2 U200.21(IO17) ; port LEDPWM7
LEDPWM8: R220.2 U200.28(IO33) ; port LEDPWM8
RX: J200.2 U200.40(RXD0)
SCL: R201.1 U200.8(IO4) ; port SCL
SDA: R202.1 U200.7(IO3) ; port SDA
TX: J200.1 U200.39(TXD0)
USBDN: U200.23(IO19) ; sheet U_usb_input/USBDN
USBDP: U200.24(IO20) ; sheet U_usb_input/USBDP
WS28: D200.3(DI) U200.25(IO21)
NetJ201_1: J201.1 Q200.3(D)
NetJ201_3: J201.3 R221.1 R224.2
NetJ201_4: J201.4 Q201.3(D) R230.1
NetLED200_A: LED200.A R205.1
NetLED201_A: LED201.A R206.1
NetR225_2: R225.2 U200.44(IO46)

Not connected (* = marked no-connect by the designer): D200 1(DO); U200 26(IO26) 27(IO47) 30(IO48) 34(IO38) 38(IO42) 41(IO45)

### Notes on the sheet
- Title
- Size:
- Date:
- A4
- Number:
- Time:
- Revision:
- Sheet
- of
- github.com/blueacro
- blueacro.com
- CERN OHL v2.0
- Made available under the
- File:
- © 2024 StackFoundry LLC. All Rights Reserved.

### Library data of the parts
BOOT200 RST200 = CMP-011-00015-1: Switch Tactile N.O. SPST Round Button Gull Wing 0.05A 12VDC 200000Cycles 2.45N SMD T/R; Contact Current Rating: 50mA; Illumination Type: Non-Illuminated; Contact Resistance: 100mR; Number of Positions: 2; Switch Function: Off-Mom; Actuator Type: Standard; Operating Force: 260gf; Voltage Rating (DC): 12V; Ratings: IP40; Switch Travel: 0.25mm; Max Operating Temperature: 70°C; Mechanical Life: 200000Cycles; Termination: Gull Wing; Throw Configuration: SPST; Series: PTS526; Height: 1.65mm; Mounting Technology: Surface Mount; Min Operating Temperature: -20°C
C200 C201 = CMP-001-00084-7: as C401 on sheet dcdc_60v_12v; Voltage: 50V
C202 = CMP-001-00083-3: as C402 on sheet dcdc_60v_12v; Voltage: 50V; Capacitance: 4.7uF; Width: 0.098inch; Height: 1.8mm; Depth: 2.5mm; Package Quantity: 1; Case/Package: 1210; Case Code (Imperial): 1210; Contact Plating: Tin; Thickness: 0.079inch; Radiation Hardening: No; Voltage Rating: 50V; Packaging: Tape and Reel; Lead Free: Lead Free; Dielectric: X7R; Min Operating Temperature: -55°C; Case Code (Metric): 3225; Max Operating Temperature: 125°C; Mount: Surface Mount; Length: 3.2mm
C203 C206 = CMP-001-00085-7: as C2 on sheet TPS922053_ch
D200 = CMP-004-00042-1: LED; SMD; 2020; RGB; 2x2x0.84mm; 3.7Ã·5.3V; Lens: transparent; 2kHz; MF: WorldSemi; Source: WS2812B2020.SchLib; Component Type: Standard; Pins: 4; Case/Package: None; SnapEDA_Link: https://www.snapeda.com/parts/WS2812B2020/Worldsemi/view-part/?ref=snap; Value: *; MP: WS2812B2020; Design Item ID: WS2812B2020; Check_prices: https://www.snapeda.com/parts/WS2812B2020/Worldsemi/view-part/?ref=eda
J200 = CMP-166-0010-1: Source: con-headers.SCHLIB; Design Item ID: M02PTH
J201 = CMP-133-0002-3: KK 254 Vertical Header, with Friction Lock, 4 Circuits, PC Tail Length: 4.00mm; Source: con-molex.SCHLIB; Contact Mating Length: 0.289inch; Color: Beige; Contact Material: Copper Alloy; Contact Plating: Tin; Design Item ID: KK-254-4
LED200 LED201 = CMP-130-0000-1: Source: led.SchLib; Design Item ID: LED0603
Q200 Q201 = CMP-094-0000-1: Design Item ID: NFET; Source: fet.SchLib
R200-R204 R207-R223 R225-R227 = CMP-009-00191-4: Res General Purpose Thick Film 0603 10K Ohm 1% 1/10W ±100ppm/°C Molded SMD Paper T/R
R205 R206 R230 = CMP-009-00193-3: as R2 on sheet TPS922053_ch
R224 R228 R229 = CMP-009-00180-2: as R8 on sheet TPS922053_ch; Resistor Type: Thick Film; Width: 0.8mm; Max Operating Temperature: 155°C; Tolerance: 1%; Radiation Hardening: No; Packaging: Tape and Reel; Case Code (Imperial): 0603; Min Operating Temperature: -55°C; Termination: SMD/SMT; Length: 1.6mm; Military Standard: Not; Case Code (Metric): 1608; Contact Plating: Tin,Matte; Height: 0.45mm; REACH SVHC: No SVHC; Voltage Rating (DC): 50V; Number of Pins: 2; Depth: 0.8mm; Lead Free: Lead Free; Resistance: 10R; Case/Package: 0603
U200 = CMP-247-000000-1: Bluetooth, WiFi 802.11b/g/n, Bluetooth v5.0 Transceiver Module 2.4GHz PCB Trace Surface Mount; MF: Espressif Systems; Source: ESP32-S3-MINI-1-N8.SchLib; Check_prices: https://www.snapeda.com/parts/ESP32-S3-MINI-1-N8/Espressif+Systems/view-part/?ref=eda; Purchase-URL: https://pricing.snapeda.com/search?q=ESP32-S3-MINI-1-N8&ref=eda; MP: ESP32-S3-MINI-1-N8; Value: *; SnapEDA_Link: https://www.snapeda.com/parts/ESP32-S3-MINI-1-N8/Espressif+Systems/view-part/?ref=snap; Package: None; Pin Count: 73; Design Item ID: ESP32-S3-MINI-1-N8; Price: None; Component Type: Standard; Availability: In Stock

## Sheet usb_input.SchDoc
size A4; SheetNumber: 4; SheetTotal: 5
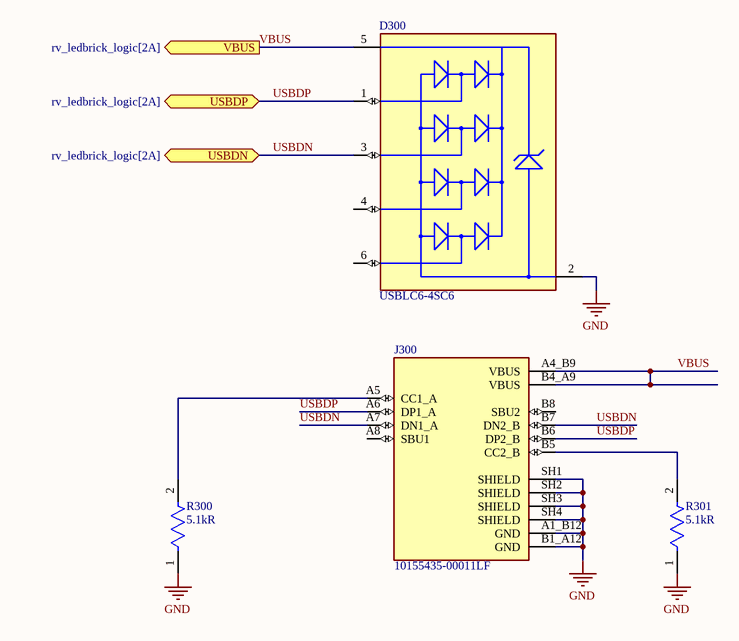
[diagram p4: usb_input.SchDoc]

### Parts
D300  USBLC6-4SC6  [FP-SOT23-6L-MFG]
J300  10155435-00011LF  [AMPHENOL_10155435-00011LF]
R300  value 5.1kR  [FP-AC0402-IPC_A]  (hidden comment: AC0402FR-075K1L)
R301  value 5.1kR  [FP-AC0402-IPC_A]  (hidden comment: AC0402FR-075K1L)

### Ports
USBDN (bidir, see rv_ledbrick_logic[2A]), USBDP (bidir, see rv_ledbrick_logic[2A]), VBUS (out, see rv_ledbrick_logic[2A])

### Nets
GND: D300.2(GND) J300.A1_B12(GND) J300.B1_A12(GND) J300.SH1(SHIELD) J300.SH2(SHIELD) J300.SH3(SHIELD) J300.SH4(SHIELD) R300.1 R301.1
VBUS: D300.5(VBUS) J300.A4_B9(VBUS) J300.B4_A9(VBUS) ; port VBUS
USBDN: D300.3(I/O2) J300.A7(DN1_A) J300.B7(DN2_B) ; port USBDN
USBDP: D300.1(I/O1) J300.A6(DP1_A) J300.B6(DP2_B) ; port USBDP
NetJ300_A5: J300.A5(CC1_A) R300.2
NetJ300_B5: J300.B5(CC2_B) R301.2

Not connected (* = marked no-connect by the designer): D300 4(I/O3) 6(I/O4); J300 A8(SBU1) B8(SBU2)

### Notes on the sheet
- Title
- Size:
- Date:
- A4
- Number:
- Time:
- Revision:
- Sheet
- of
- github.com/blueacro
- blueacro.com
- CERN OHL v2.0
- Made available under the
- File:
- © 2024 StackFoundry LLC. All Rights Reserved.

### Library data of the parts
D300 = CMP-004-00040-1: ESD Suppressor 15KV 6-Pin SOT-23 T/R - Product that comes on tape, but is not reeled; Clamping Voltage-Max: 17V; Direction: Unidirectional; Operating Supply Voltage: 860mV; Max Breakdown Voltage: 10V; Reverse Breakdown Voltage: 6V; Leakage Current: 150nA; Max Reverse Leakage Current: 2uA; Value: 4pF; Power Line Protection: Yes; Peak Pulse Current: 5A; Polarity: Unidirectional,Bidirectional; Number of Channels: 4; Test Current: 1mA; Number of Elements: 1; Voltage Rating (DC): 5V; Max Operating Temperature: 125°C; Termination: SMD/SMT; Case/Package: SOT-23; Reach SVHC Compliant: No; Width: 1.75mm; Lead Free: Lead Free; Packaging: Tape and Reel; Radiation Hardening: No; Length: 3.05mm; Pins: 6; Mounting Technology: Surface Mount; Min Operating Temperature: -40°C; Depth: 1.75mm; ESD Protection: Yes; Clamping Voltage: 17V; RoHS Compliant: Yes; Height: 1.3mm; Series: USB; Min Breakdown Voltage: 6V; Working Voltage: 5V; Breakdown Voltage: 6V; Number of Unidirectional Channels: 4; Reverse Standoff Voltage: 5V
J300 = CMP-243-000000-3: 16 Position 5 A USB Right Angle Receptacle Connector; MF: Amphenol ICC (FCI); MP: 10155435-00011LF; Availability: Unavailable; Design Item ID: 10155435-00011LF; Source: 10155435-00011LF.SchLib; Price: None; Package: None; Component Type: Standard; Value: *; Pin Count: 16
R300 R301 = CMP-009-00234-1: SMD Chip Resistor, 5.1 kOhm, ± 1%, 63 mW, 0402 [1005 Metric], Thick Film, General Purpose; Power Rating: 63mW; Temperature Coefficient: 100ppm/°C; Voltage Rating: 50V; Height: 0.015inch; Case/Package: 0402; Features: Moisture Resistant,Automotive AEC-Q200; Max Operating Temperature: 155°C; Case Code (Metric): 1005; Max Power Dissipation: 63mW; Width: 0.02inch; Packaging: Cut Tape; Min Operating Temperature: -55°C; Series: AC; Case Code (Imperial): 0402; Mounting Technology: Surface Mount; Tolerance: 1%; Lead Free: Lead Free; Length: 0.039inch; RoHS Compliant: Yes; Number of Terminations: 2

## Sheet vin_shunt.SchDoc
size A; SheetNumber: 6; SheetTotal: 6
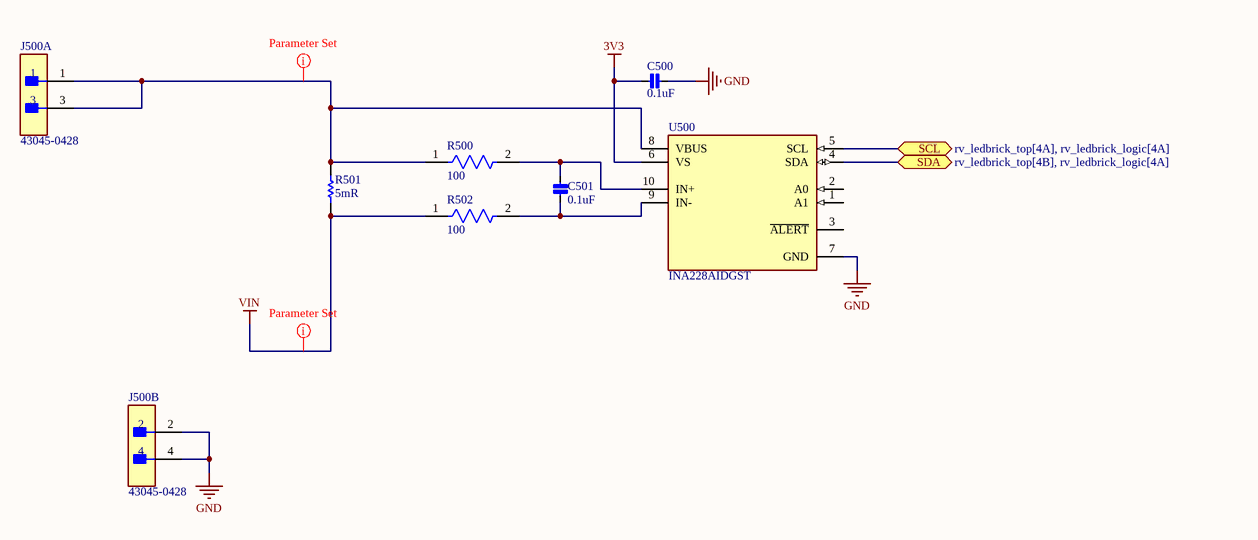
[diagram p5: vin_shunt.SchDoc]

### Parts
C500  value 0.1uF  [FP-CL10-IPC_B]  (hidden comment: CAP 0.1uF 50V X7R 0603)
C501  value 0.1uF  [FP-CL10-IPC_B]  (hidden comment: CAP 0.1uF 50V X7R 0603)
J500  43045-0428  [FP-43045-0428-MFG]  (parts A,B of 2)
R500  value 100  [FP-RC0603-0_55-MFG]  (hidden comment: 100R 0603 1%)
R501  value 5mR  [RESC7146X09N]  (hidden comment: 0R005 HOXLR2817-5W-5MR-1%)
R502  value 100  [FP-RC0603-0_55-MFG]  (hidden comment: 100R 0603 1%)
U500  INA228AIDGST  [FP-DGS0010A-IPC_C]

### Ports
SCL (bidir, see rv_ledbrick_top[4A], rv_ledbrick_logic[4A]), SDA (bidir, see rv_ledbrick_top[4B], rv_ledbrick_logic[4A])

### Nets
3V3: C500.1 U500.6(VS)
GND: C500.2 J500.2 J500.4 U500.7(GND)
VIN: R501.1 R502.1
SCL: U500.5(SCL) ; port SCL
SDA: U500.4(SDA) ; port SDA
NetC501_1: C501.1 R500.2 U500.10(IN+)
NetC501_2: C501.2 R502.2 U500.9(IN-)
NetJ500_1: J500.1 J500.3 R500.1 R501.2 U500.8(VBUS)

Not connected (* = marked no-connect by the designer): U500 1(A1) 2(A0) 3(~{ALERT})

### Layout directives
net class HV: NetJ500_1, VIN

### Library data of the parts
C500 C501 = CMP-001-00084-7: as C401 on sheet dcdc_60v_12v; Voltage: 50V
J500 = CMP-002-00096-1: PCB Header Temperature range: max. 105 °C Housing Material: Thermoplastic Poles: 4 Rated current: 5 A; Contact Gender: Male; Contact Material: Brass; Case/Package: 0428; Color: Black
R500 R502 = CMP-009-00246-1: Fixed Resistor, Metal Glaze/thick Film, 0.1W, 100ohm, 75V, 1% +/-Tol, 100ppm/Cel, Surface Mount, 0603; Package Width: 0.8mm; Package Length: 1.6mm; Package Height: 0.45mm; Power: 100mW; Temperature Coefficient: 100ppm/°C; Additional Feature: LASER TRIMMABLE; Rated Temperature: 70°C; Package Shape: Rectangular; RoHS Compliant: Yes; Mounting Technology: Surface Mount; Package Style: SMTMeter; Terminal Finish: Nickel; Min Operating Temperature: -55°C; Packaging: Tape and Reel; Technology: METAL GLAZE/THICK FILM; Case/Package: 0603; Pins: 2; Construction: Chip; Tolerance: 1%; JESD-609 Code: e3; Max Operating Temperature: 155°C; Reach SVHC Compliant: Yes; Working Voltage: 75V; Resistor Type: FIXED RESISTOR; Termination: Wraparound
R501 = CMP-009-00241-2: Res Metal Strip 2818 0.005 Ohm 1% 5W ±200ppm/°C Pad SMD Automotive T/R; Reach SVHC Compliant: Unknown; Min Operating Temperature: -65°C; Tolerance: 1%; Case Code (Metric): 7146; Max Power Dissipation: 5W; Width: 4.6mm; Resistor Type: Metal Strip; Radiation Hardening: No; Length: 0.28inch; Features: Moisture Resistant,Automotive AEC-Q200; Power Rating: 5W; Max Operating Temperature: 170°C; Series: WSH2818; Packaging: Cut Tape; Temperature Coefficient: 200ppm/°C; RoHS Compliant: Yes; Case/Package: 2818; Package Quantity: 1; Termination: SMD/SMT; Case Code (Imperial): 2818; Resistance Tolerance: 1%; Height: 0.055inch; Number of Terminations: 2
U500 = CMP-015-00018-1: Power Supply Support Circuit, Adjustable, 1 Channel, PDSO10

## Nets that join several sheets
3V3: rv_ledbrick_top (J3.4 R10.2), dcdc_60v_12v (5 pins), rv_ledbrick_logic (15 pins), vin_shunt (C500.1 U500.6)
12V: dcdc_60v_12v (6 pins), rv_ledbrick_logic (J201.2)
GND: rv_ledbrick_top (C5.1 C6.1 J3.5), A (8 pins), B (8 pins), C (8 pins), D (8 pins), E (8 pins), F (8 pins), G (8 pins), H (8 pins), dcdc_60v_12v (12 pins), rv_ledbrick_logic (63 pins), usb_input (9 pins), vin_shunt (C500.2 J500.2 J500.4 U500.7)
VBUS: dcdc_60v_12v (D400.A), usb_input (D300.5 J300.A4_B9 J300.B4_A9)
VIN: rv_ledbrick_top (12 pins), A (D1_A.3 U1_A.1), B (D1_B.3 U1_B.1), C (D1_C.3 U1_C.1), D (D1_D.3 U1_D.1), E (D1_E.3 U1_E.1), F (D1_F.3 U1_F.1), G (D1_G.3 U1_G.1), H (D1_H.3 U1_H.1), dcdc_60v_12v (C400.2 C402.2 U400.4 U400.5), vin_shunt (R501.1 R502.1)
1W: rv_ledbrick_top (J3.6 R10.1), rv_ledbrick_logic (U200.37)
CSP: rv_ledbrick_top (J1.1), A (5 pins)
CSP: rv_ledbrick_top (J1.2), B (5 pins)
CSP: rv_ledbrick_top (J1.3), C (5 pins)
CSP: rv_ledbrick_top (J1.4), D (5 pins)
CSP: rv_ledbrick_top (J1.5), E (5 pins)
CSP: rv_ledbrick_top (J1.6), F (5 pins)
CSP: rv_ledbrick_top (J1.7), G (5 pins)
CSP: rv_ledbrick_top (J1.8), H (5 pins)
F1: A (U1_A.5), B (U1_B.5), C (U1_C.5), D (U1_D.5), rv_ledbrick_logic (R226.1 R228.2)
F2: E (U1_E.5), F (U1_F.5), G (U1_G.5), H (U1_H.5), rv_ledbrick_logic (R227.1 R229.2)
LEDAO1: A (R8_A.1), rv_ledbrick_logic (R200.2 U200.10)
LEDAO2: B (R8_B.1), rv_ledbrick_logic (R207.2 U200.12)
LEDAO3: C (R8_C.1), rv_ledbrick_logic (R209.2 U200.14)
LEDAO4: D (R8_D.1), rv_ledbrick_logic (R211.2 U200.16)
LEDAO5: E (R8_E.1), rv_ledbrick_logic (R213.2 U200.18)
LEDAO6: F (R8_F.1), rv_ledbrick_logic (R215.2 U200.20)
LEDAO7: G (R8_G.1), rv_ledbrick_logic (R217.2 U200.22)
LEDAO8: H (R8_H.1), rv_ledbrick_logic (R219.2 U200.29)
LEDPWM1: A (R9_A.1), rv_ledbrick_logic (R203.2 U200.9)
LEDPWM2: B (R9_B.1), rv_ledbrick_logic (R208.2 U200.11)
LEDPWM3: C (R9_C.1), rv_ledbrick_logic (R210.2 U200.13)
LEDPWM4: D (R9_D.1), rv_ledbrick_logic (R212.2 U200.15)
LEDPWM5: E (R9_E.1), rv_ledbrick_logic (R214.2 U200.17)
LEDPWM6: F (R9_F.1), rv_ledbrick_logic (R216.2 U200.19)
LEDPWM7: G (R9_G.1), rv_ledbrick_logic (R218.2 U200.21)
LEDPWM8: H (R9_H.1), rv_ledbrick_logic (R220.2 U200.28)
SCL: rv_ledbrick_top (J3.3), rv_ledbrick_logic (R201.1 U200.8), vin_shunt (U500.5)
SDA: rv_ledbrick_top (J3.2), rv_ledbrick_logic (R202.1 U200.7), vin_shunt (U500.4)
USBDN: rv_ledbrick_logic (U200.23), usb_input (D300.3 J300.A7 J300.B7)
USBDP: rv_ledbrick_logic (U200.24), usb_input (D300.1 J300.A6 J300.B6)